# EAGLE schematic KMO_IO_MV2_3 (EAGLE 9.4.0)

## Sheet 1 of 2
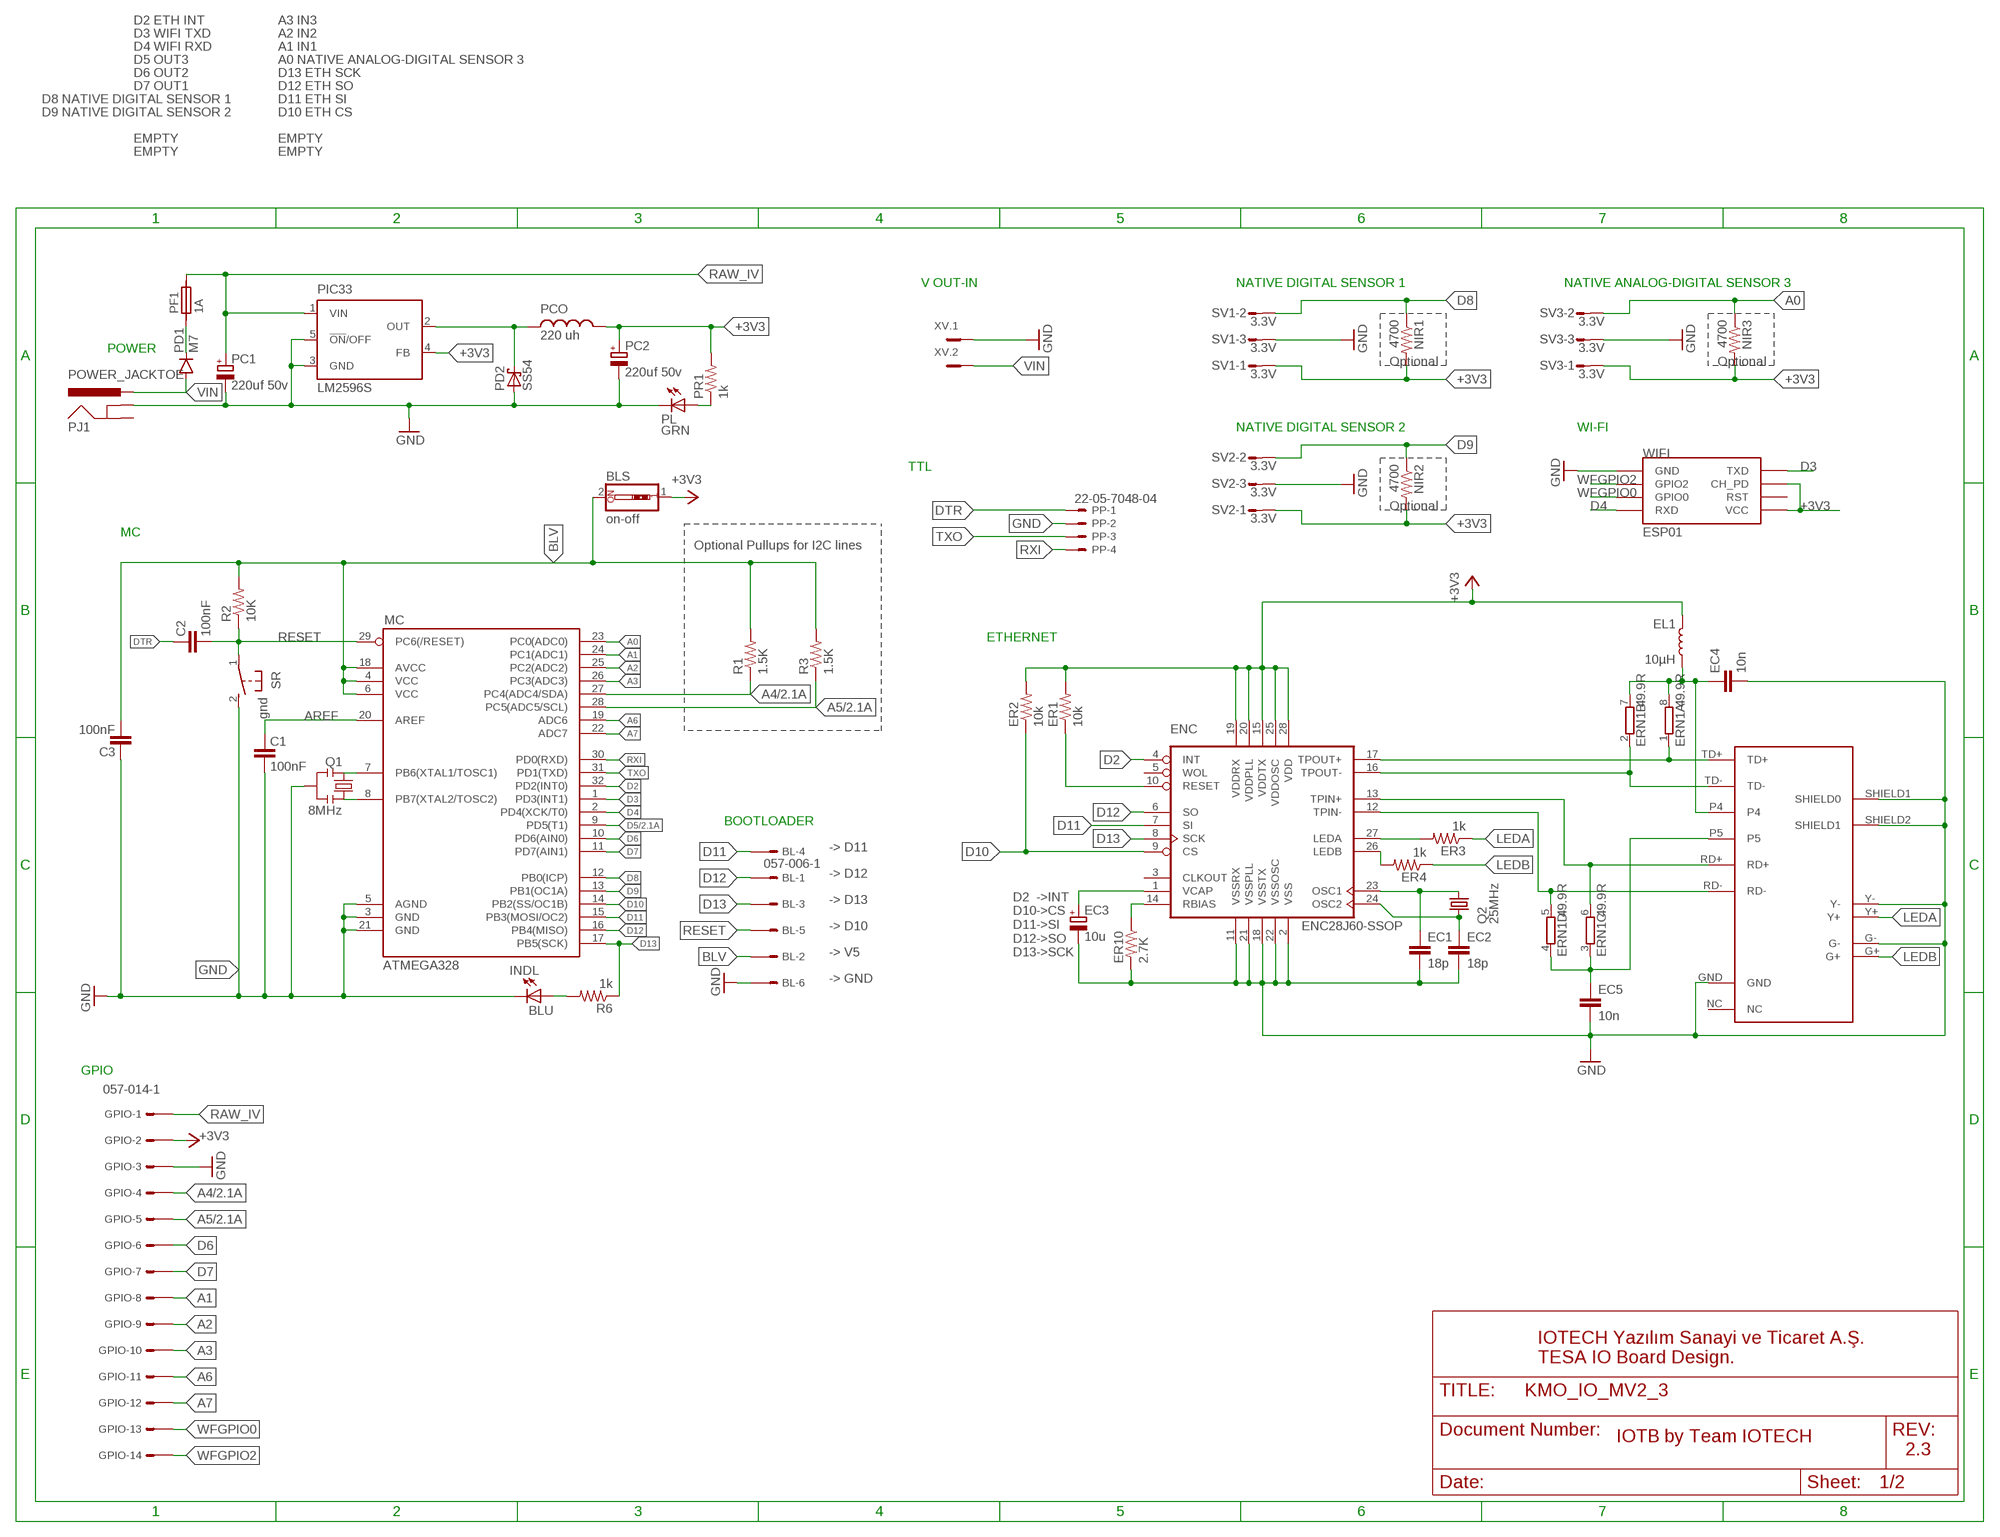
[diagram p0: schematic, sheet 1]

### Parts
BL  057-006-1  [057-006-1]
BLS  on-off  SW_DIP-1  [EDG-01]
C1  100nF  CAP0805  [0805]
C2  100nF  CAP0805  [0805]
C3  100nF  CAP0805  [0805]
EC1  18p  CAP0805  [0805]
EC2  18p  CAP0805  [0805]
EC3  10u  CPOL-EUCT3216  [CT3216]
EC4  10n  CAP0805  [0805]
EC5  10n  CAP0805  [0805]
EL1  10µH  INDUCTOR-0805-3.3UH  [0805]
ENC  ENC28J60-SSOP  [SSOP28]
ER1  10k  RESISTOR0805-RES  [0805]
ER2  10k  RESISTOR0805-RES  [0805]
ER3  1k  RESISTOR0805-RES  [0805]
ER4  1k  RESISTOR0805-RES  [0805]
ER10  2.7K  RESISTOR0805-RES  [0805]
ERN1  49.9R  4R-N0603-ARV  [0603-ARV]
GPIO  057-014-1  [057-014-1]
INDL  BLU  LEDCHIP-LED0805  [CHIP-LED0805]
MC  ATMEGA328  ATMEGA168  [TQFP32-08]
NIR1  4700  RESISTOR0805-RES  [0805]
NIR2  4700  RESISTOR0805-RES  [0805]
NIR3  4700  RESISTOR0805-RES  [0805]
PC1  220uf 50v  CPOL-EU140CLH-1010  [140CLH-1010]
PC2  220uf 50v  CPOL-EU140CLH-1010  [140CLH-1010]
PCO  220 uh  MSS1260  [MSS1260]
PD1  M7  DIODESMA  [SMA-DIODE]
PD2  SS54  SCHOTTKY-DIODESMD  [SMB]
PF1  1A  SIBA194600  [1820]
PIC33  LM2596S  [TO263-5]
PJ1  POWER_JACKTOE  [POWER_JACK_SMD_OVERPASTE_TOE]
PL  GRN  LEDCHIP-LED0805  [CHIP-LED0805]
PP  22-05-7048-04  [7395-04]
PR1  1k  RESISTOR0805-RES  [0805]
Q1  8MHz  RESONATOR1:1  [RESONATOR-SMD-1:1]
Q2  25MHz  KX-9B  [5.0X3.2_2]
R1  1.5K  RESISTOR0805-RES  [0805]
R2  10K  RESISTOR0805-RES  [0805]
R3  1.5K  RESISTOR0805-RES  [0805]
R6  1k  RESISTOR0805-RES  [0805]
SR  gnd  31-XX  [B3F-31XX]
SV1  3.3V  S03P  [S03P]
SV2  3.3V  S03P  [S03P]
SV3  3.3V  S03P  [S03P]
U$2  HR911105A  [RJ45]
WIFI  ESP01  [ESP01]
XV  MC2  [MC2]

### Nets
+3V3 [3.3 power line]: BLS.1 EL1.1 ENC.15(VDDTX) ENC.19(VDDRX) ENC.20(VDDPLL) ENC.25(VDDOSC) ENC.28(VDD) ER1.2 ER2.2 GPIO.2 NIR1.2 NIR2.2 NIR3.2 PC2.+ PCO.P$1 PIC33.4(FB) PR1.2 SV1.1 SV2.1 SV3.1 WIFI.CH_PD WIFI.VCC ; also sheet 2
A0: MC.23(PC0(ADC0)) NIR3.1 SV3.2
A1: GPIO.8 MC.24(PC1(ADC1))
A2: GPIO.9 MC.25(PC2(ADC2))
A3: GPIO.10 MC.26(PC3(ADC3))
A4: GPIO.4 MC.27(PC4(ADC4/SDA)) R1.1 ; also sheet 2
A5: GPIO.5 MC.28(PC5(ADC5/SCL)) R3.1 ; also sheet 2
A6: GPIO.11 MC.19(ADC6)
A7: GPIO.12 MC.22(ADC7)
AREF: C1.2 MC.20(AREF)
BLV: BL.2 BLS.2 C3.1 MC.4(VCC) MC.6(VCC) MC.18(AVCC) R1.2 R2.2 R3.2
D2: ENC.4(INT) MC.32(PD2(INT0))
D3: MC.1(PD3(INT1)) WIFI.TX(TXD)
D4: MC.2(PD4(XCK/T0)) WIFI.RX(RXD)
D5: MC.9(PD5(T1)) ; also sheet 2
D6: GPIO.6 MC.10(PD6(AIN0))
D7: GPIO.7 MC.11(PD7(AIN1))
D8: MC.12(PB0(ICP)) NIR1.1 SV1.2
D9: MC.13(PB1(OC1A)) NIR2.1 SV2.2
D10: ENC.9(CS) ER2.1 MC.14(PB2(SS/OC1B))
D11: BL.4 ENC.7(SI) MC.15(PB3(MOSI/OC2))
D12: BL.1 ENC.6(SO) MC.16(PB4(MISO))
D13: BL.3 ENC.8(SCK) MC.17(PB5(SCK)) R6.1
DTR: C2.2 PP.1
EP4: EC4.1 EL1.2 ERN1.7 ERN1.8 U$2.P4
EP5: EC5.1 ERN1.3 ERN1.4 U$2.P5
GND [3.3 power line]: BL.6 C1.1 C3.2 EC1.2 EC2.2 EC3.- EC4.2 EC5.2 ENC.2(VSS) ENC.11(VSSRX) ENC.18(VSSTX) ENC.21(VSSPLL) ENC.22(VSSOSC) ER10.2 GPIO.3 INDL.C MC.3(GND) MC.5(AGND) MC.21(GND) PC1.- PC2.- PD2.A PIC33.3(GND) PIC33.5(!ON!/OFF) PJ1.GND(GNDBREAK) PL.C PP.2 Q1.2 SR.2(S) SV1.3 SV2.3 SV3.3 U$2.G- U$2.GND U$2.SHIELD1(SHIELD0) U$2.SHIELD2(SHIELD1) U$2.Y- WIFI.GND XV.1 ; also sheet 2
LEDA: ER3.1 U$2.Y+
LEDB: ER4.1 U$2.G+
N$2: PD1.C PF1.1
N$5: INDL.A R6.2
N$9: ENC.27(LEDA) ER3.2
N$10: MC.8(PB7(XTAL2/TOSC2)) Q1.3
N$11: PL.A PR1.1
N$13: EC3.+ ENC.1(VCAP)
N$14: ENC.26(LEDB) ER4.2
N$15: MC.7(PB6(XTAL1/TOSC1)) Q1.1
N$16: PCO.P$2 PD2.C PIC33.2(OUT)
N$17: ENC.10(RESET) ER1.1
N$19: ENC.14(RBIAS) ER10.1
N$22: EC2.1 ENC.24(OSC2) Q2.1
N$24: EC1.1 ENC.23(OSC1) Q2.2
RAW_IV [vcc]: GPIO.1 PC1.+ PF1.2 PIC33.1(VIN)
RD+: ENC.13(TPIN+) ERN1.6 U$2.RD+
RD-: ENC.12(TPIN-) ERN1.5 U$2.RD-
RESET: BL.5 C2.1 MC.29(PC6(/RESET)) R2.1 SR.1(P)
RXI: MC.30(PD0(RXD)) PP.4
TD+: ENC.17(TPOUT+) ERN1.1 U$2.TD+
TD-: ENC.16(TPOUT-) ERN1.2 U$2.TD-
TXO: MC.31(PD1(TXD)) PP.3
VIN: PD1.A PJ1.VIN0(PWR) XV.2
WFGPIO0: GPIO.13 WIFI.GPIO0
WFGPIO2: GPIO.14 WIFI.GPIO2
Unconnected: ENC.3(CLKOUT) ENC.5(WOL) PJ1.P$4(GND) U$2.NC WIFI.RST

### Notes on the sheet
- D2 ETH INT | A3 IN3
- D3 WIFI TXD | A2 IN2
- D4 WIFI RXD | A1 IN1
- D5 OUT3 | A0 NATIVE ANALOG-DIGITAL SENSOR 3
- D6 OUT2 | D13 ETH SCK
- D7 OUT1 | D12 ETH SO
- D8 NATIVE DIGITAL SENSOR 1 | D11 ETH SI
- D9 NATIVE DIGITAL SENSOR 2 | D10 ETH CS
- EMPTY | EMPTY
- EMPTY | EMPTY
- V OUT-IN | NATIVE DIGITAL SENSOR 1 | NATIVE ANALOG-DIGITAL SENSOR 3
- POWER
- Optional | Optional
- NATIVE DIGITAL SENSOR 2 | WI-FI
- TTL
- Optional
- MC
- Optional Pullups for I2C lines
- ETHERNET
- BOOTLOADER
- -> D11
- -> D12
- -> D13
- -> D10
- -> V5
- D2  ->INT
  D10->CS
  D11->SI
  D12->SO
  D13->SCK
- -> GND
- GPIO
- IOTECH Yazılım Sanayi ve Ticaret A.Ş.
  TESA IO Board Design.
- IOTB by Team IOTECH
- 2.3

## Sheet 2 of 2
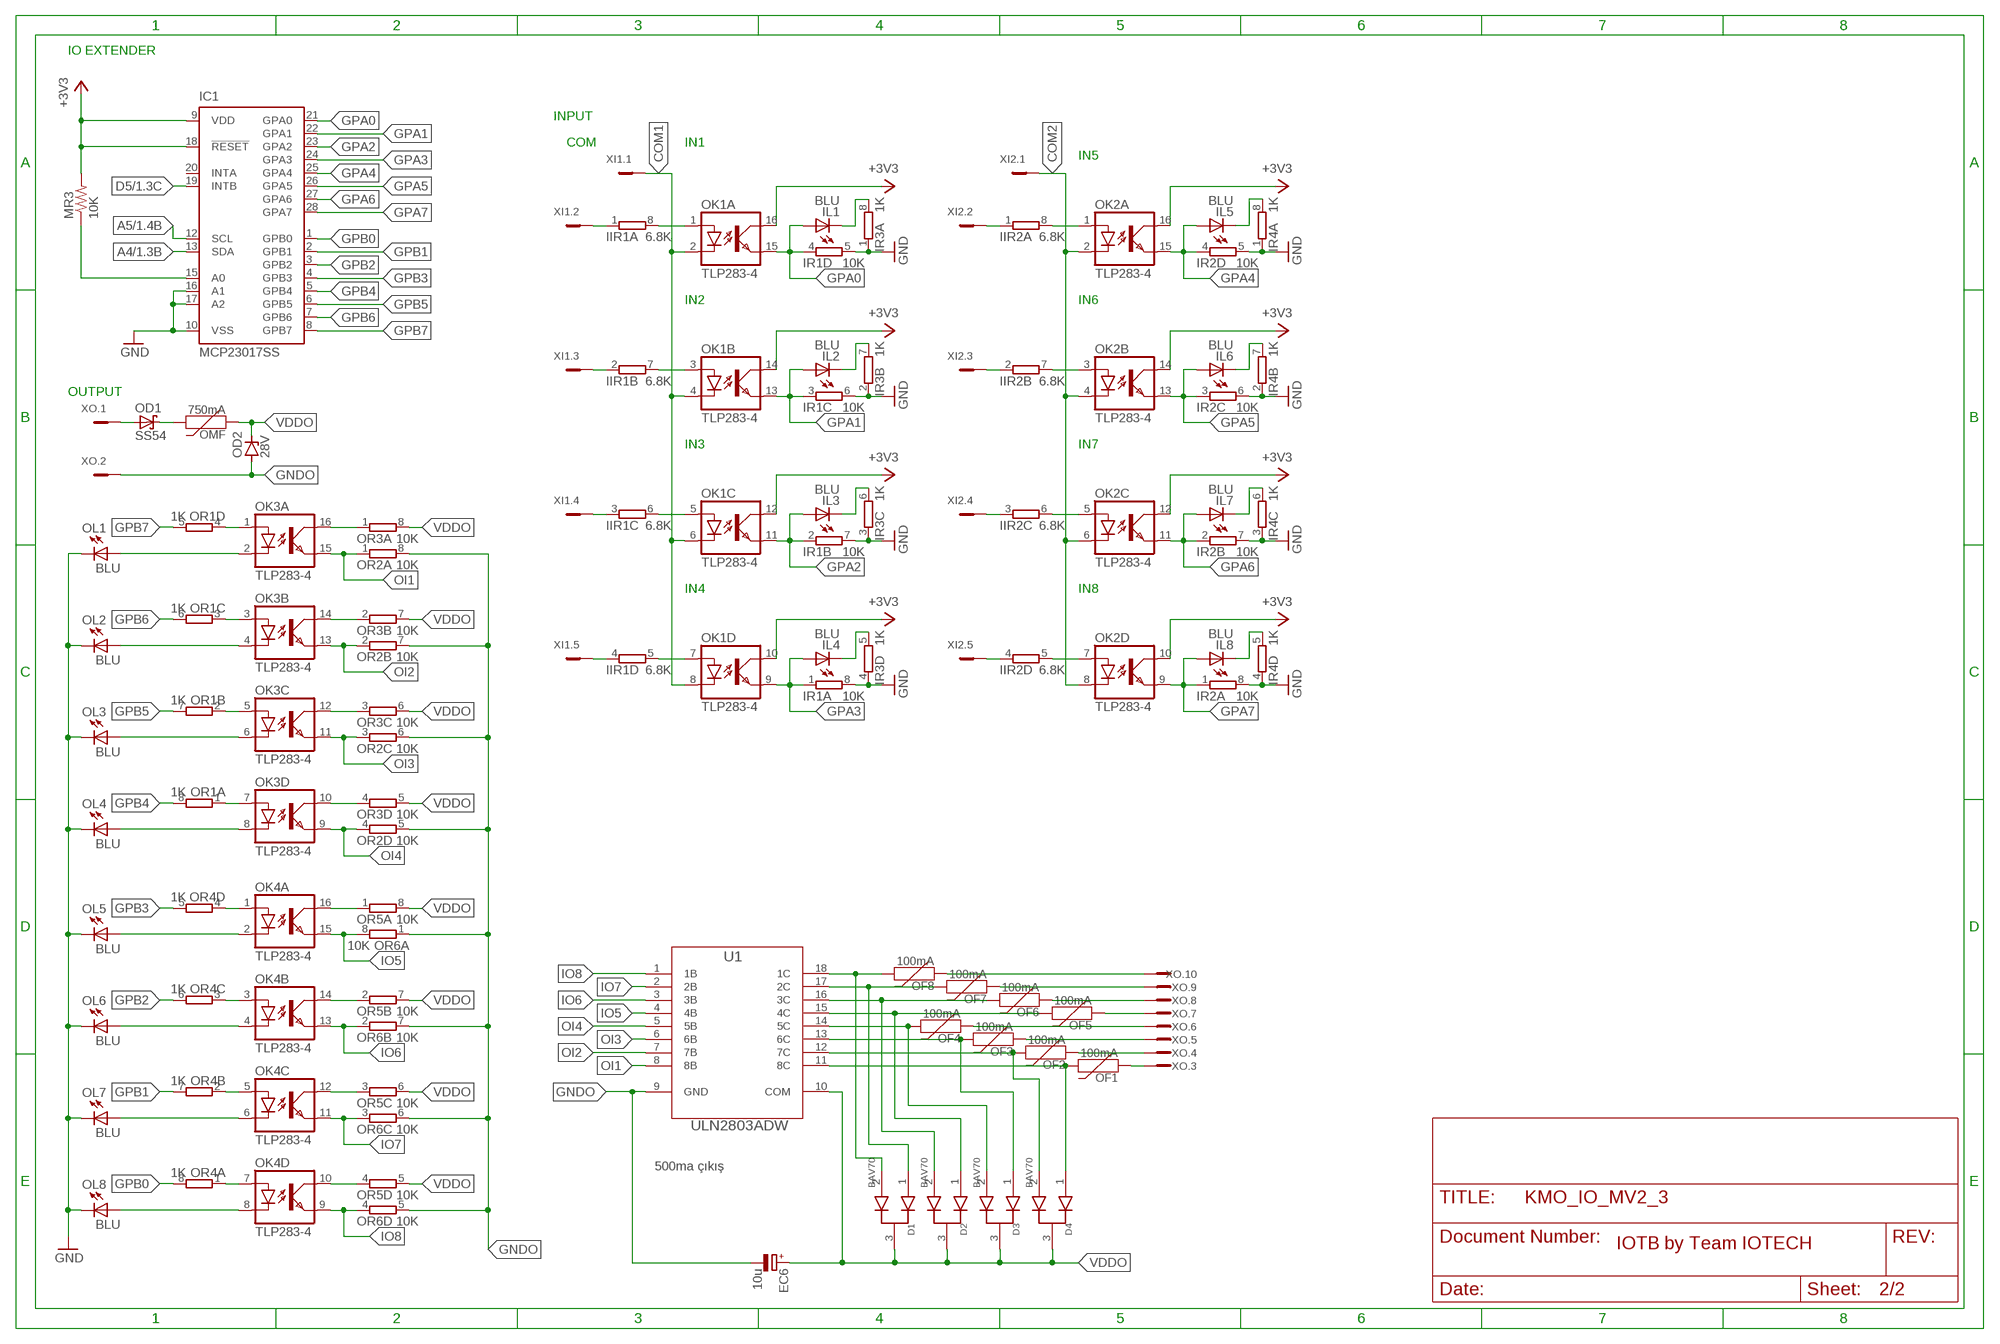
[diagram p1: schematic, sheet 2]

### Parts
D1  BAV70  [SOT-23-3]
D2  BAV70  [SOT-23-3]
D3  BAV70  [SOT-23-3]
D4  BAV70  [SOT-23-3]
EC6  10u  CPOL-EUCT3216  [CT3216]
IC1  MCP23017SS  [SSOP28]
IIR1  6.8K  4R-N0603-ARV  [0603-ARV]
IIR2  6.8K  4R-N0603-ARV  [0603-ARV]
IL1  BLU  LEDCHIP-LED0805  [CHIP-LED0805]
IL2  BLU  LEDCHIP-LED0805  [CHIP-LED0805]
IL3  BLU  LEDCHIP-LED0805  [CHIP-LED0805]
IL4  BLU  LEDCHIP-LED0805  [CHIP-LED0805]
IL5  BLU  LEDCHIP-LED0805  [CHIP-LED0805]
IL6  BLU  LEDCHIP-LED0805  [CHIP-LED0805]
IL7  BLU  LEDCHIP-LED0805  [CHIP-LED0805]
IL8  BLU  LEDCHIP-LED0805  [CHIP-LED0805]
IR1  10K  4R-N0603-ARV  [0603-ARV]
IR2  10K  4R-N0603-ARV  [0603-ARV]
IR3  1K  4R-N0603-ARV  [0603-ARV]
IR4  1K  4R-N0603-ARV  [0603-ARV]
MR3  10K  RESISTOR0805-RES  [0805]
OD1  SS54  SCHOTTKY-DIODESMD  [SMB]
OD2  28V  ZENER-DIODESMB  [SMB]
OF1  100mA  PPTC_0.75A  [1206]
OF2  100mA  PPTC_0.75A  [1206]
OF3  100mA  PPTC_0.75A  [1206]
OF4  100mA  PPTC_0.75A  [1206]
OF5  100mA  PPTC_0.75A  [1206]
OF6  100mA  PPTC_0.75A  [1206]
OF7  100mA  PPTC_0.75A  [1206]
OF8  100mA  PPTC_0.75A  [1206]
OK1  TLP283-4  [MINI-FLAT-16]
OK2  TLP283-4  [MINI-FLAT-16]
OK3  TLP283-4  [MINI-FLAT-16]
OK4  TLP283-4  [MINI-FLAT-16]
OL1  BLU  LEDCHIP-LED0805  [CHIP-LED0805]
OL2  BLU  LEDCHIP-LED0805  [CHIP-LED0805]
OL3  BLU  LEDCHIP-LED0805  [CHIP-LED0805]
OL4  BLU  LEDCHIP-LED0805  [CHIP-LED0805]
OL5  BLU  LEDCHIP-LED0805  [CHIP-LED0805]
OL6  BLU  LEDCHIP-LED0805  [CHIP-LED0805]
OL7  BLU  LEDCHIP-LED0805  [CHIP-LED0805]
OL8  BLU  LEDCHIP-LED0805  [CHIP-LED0805]
OMF  750mA  PPTC_0.75A  [1206]
OR1  1K  4R-N0603-ARV  [0603-ARV]
OR2  10K  4R-N0603-ARV  [0603-ARV]
OR3  10K  4R-N0603-ARV  [0603-ARV]
OR4  1K  4R-N0603-ARV  [0603-ARV]
OR5  10K  4R-N0603-ARV  [0603-ARV]
OR6  10K  4R-N0603-ARV  [0603-ARV]
U1  ULN2803ADW  [SOIC127P1030X265-18N]
XI1  MC5  [MC5]
XI2  MC5  [MC5]
XO  MC10  [MC10]

### Nets
+3V3 [3.3 power line]: IC1.9(VDD) IC1.18(!RESET) MR3.2 OK1.10(D:COL) OK1.12(C:COL) OK1.14(B:COL) OK1.16(A:COL) OK2.10(D:COL) OK2.12(C:COL) OK2.14(B:COL) OK2.16(A:COL) ; also sheet 1
A4: IC1.13(SDA) ; also sheet 1
A5: IC1.12(SCL) ; also sheet 1
COM1: OK1.2(A:C) OK1.4(B:C) OK1.6(C:C) OK1.8(D:C) XI1.1
COM2: OK2.2(A:C) OK2.4(B:C) OK2.6(C:C) OK2.8(D:C) XI2.1
D5: IC1.19(INTB) ; also sheet 1
GND [3.3 power line]: IC1.10(VSS) IC1.16(A1) IC1.17(A2) IR1.5 IR1.6 IR1.7 IR1.8 IR2.5 IR2.6 IR2.7 IR2.8 IR3.1 IR3.2 IR3.3 IR3.4 IR4.1 IR4.2 IR4.3 IR4.4 OL1.C OL2.C OL3.C OL4.C OL5.C OL6.C OL7.C OL8.C ; also sheet 1
GNDO [outsise power line]: EC6.- OD2.A OR2.5 OR2.6 OR2.7 OR2.8 OR6.1 OR6.5 OR6.6 OR6.7 U1.9(GND) XO.2
GPA0: IC1.21(GPA0) IL1.A IR1.4 OK1.15(A:EMIT)
GPA1: IC1.22(GPA1) IL2.A IR1.3 OK1.13(B:EMIT)
GPA2: IC1.23(GPA2) IL3.A IR1.2 OK1.11(C:EMIT)
GPA3: IC1.24(GPA3) IL4.A IR1.1 OK1.9(D:EMIT)
GPA4: IC1.25(GPA4) IL5.A IR2.4 OK2.15(A:EMIT)
GPA5: IC1.26(GPA5) IL6.A IR2.3 OK2.13(B:EMIT)
GPA6: IC1.27(GPA6) IL7.A IR2.2 OK2.11(C:EMIT)
GPA7: IC1.28(GPA7) IL8.A IR2.1 OK2.9(D:EMIT)
GPB0: IC1.1(GPB0) OR4.8
GPB1: IC1.2(GPB1) OR4.7
GPB2: IC1.3(GPB2) OR4.6
GPB3: IC1.4(GPB3) OR4.5
GPB4: IC1.5(GPB4) OR1.8
GPB5: IC1.6(GPB5) OR1.7
GPB6: IC1.7(GPB6) OR1.6
GPB7: IC1.8(GPB7) OR1.5
IO5: OK4.15(A:EMIT) OR6.8 U1.4(4B)
IO6: OK4.13(B:EMIT) OR6.2 U1.3(3B)
IO7: OK4.11(C:EMIT) OR6.3 U1.2(2B)
IO8: OK4.9(D:EMIT) OR6.4 U1.1(1B)
N$1: OD1.A XO.1
N$3: IC1.15(A0) MR3.1
N$4: OD1.C OMF.2
N$6: OF8.1 XO.10
N$7: D1.1 OF7.2 U1.17(2C)
N$8: OK3.1(A:A) OR1.4
N$12: IL1.C IR3.8
N$18: IIR1.1 XI1.2
N$20: IL2.C IR3.7
N$21: IL3.C IR3.6
N$23: IL4.C IR3.5
N$25: IL5.C IR4.8
N$26: IL6.C IR4.7
N$27: IL7.C IR4.6
N$28: IIR1.2 XI1.3
N$29: IIR1.8 OK1.1(A:A)
N$30: IIR1.7 OK1.3(B:A)
N$31: IIR1.6 OK1.5(C:A)
N$32: IIR1.5 OK1.7(D:A)
N$33: IIR1.3 XI1.4
N$34: IIR1.4 XI1.5
N$35: OK3.3(B:A) OR1.3
N$36: IIR2.1 XI2.2
N$37: IIR2.8 OK2.1(A:A)
N$38: IIR2.2 XI2.3
N$39: IIR2.7 OK2.3(B:A)
N$40: IIR2.3 XI2.4
N$41: IIR2.6 OK2.5(C:A)
N$42: IIR2.4 XI2.5
N$43: IIR2.5 OK2.7(D:A)
N$44: IL8.C IR4.5
N$45: OK3.5(C:A) OR1.2
N$46: OK3.7(D:A) OR1.1
N$47: D1.2 OF8.2 U1.18(1C)
N$48: OK3.16(A:COL) OR3.1
N$49: D2.2 OF6.2 U1.16(3C)
N$50: D2.1 OF5.2 U1.15(4C)
N$51: OF7.1 XO.9
N$52: OF6.1 XO.8
N$53: OK3.14(B:COL) OR3.2
N$54: OF5.1 XO.7
N$55: OF4.1 XO.6
N$56: OK3.12(C:COL) OR3.3
N$57: D3.1 OF3.2 U1.13(6C)
N$58: OK3.10(D:COL) OR3.4
N$59: D4.2 OF2.2 U1.12(7C)
N$60: OK3.2(A:C) OL1.A
N$61: OK3.4(B:C) OL2.A
N$62: OK3.6(C:C) OL3.A
N$63: OK3.8(D:C) OL4.A
N$64: D4.1 OF1.2 U1.11(8C)
N$65: D3.2 OF4.2 U1.14(5C)
N$66: OF3.1 XO.5
N$67: OF2.1 XO.4
N$68: OF1.1 XO.3
N$69: OK4.1(A:A) OR4.4
N$70: OK4.3(B:A) OR4.3
N$71: OK4.5(C:A) OR4.2
N$72: OK4.7(D:A) OR4.1
N$73: OK4.16(A:COL) OR5.1
N$74: OK4.14(B:COL) OR5.2
N$75: OK4.12(C:COL) OR5.3
N$76: OK4.10(D:COL) OR5.4
N$77: OK4.2(A:C) OL5.A
N$78: OK4.4(B:C) OL6.A
N$79: OK4.6(C:C) OL7.A
N$80: OK4.8(D:C) OL8.A
OI1: OK3.15(A:EMIT) OR2.1 U1.8(8B)
OI2: OK3.13(B:EMIT) OR2.2 U1.7(7B)
OI3: OK3.11(C:EMIT) OR2.3 U1.6(6B)
OI4: OK3.9(D:EMIT) OR2.4 U1.5(5B)
VDDO [outsise power line]: D1.3 D2.3 D3.3 D4.3 EC6.+ OD2.C OMF.1 OR3.5 OR3.6 OR3.7 OR3.8 OR5.5 OR5.6 OR5.7 OR5.8 U1.10(COM)
Unconnected: IC1.20(INTA)

### Notes on the sheet
- IO EXTENDER
- INPUT
- COM | IN1
- IN5
- IN2 | IN6
- OUTPUT
- IN3 | IN7
- IN4 | IN8
- 500ma çıkış
- IOTB by Team IOTECH

## Library data of the parts
BL = con-panduit:057-006-: CONNECTOR 6-pin series 057 contact pc board low profile headers; OC_FARNELL: unknown; OC_NEWARK: unknown
BLS = special:SW_DIP-1: DIP SWITCH
C1-C3 EC1 EC2 EC4 EC5 = SparkFun-Passives:CAP: Capacitor Standard 0603 ceramic capacitor, and 0.1" leaded capacitor.
D1-D4 = BAV70:BAV70; AVAILABILITY: Unavailable; DESCRIPTION: Diode, Dual Switching, Sot-23; MF: Multicomp; MP: BAV70+; PACKAGE: SOT-23 Multicomp; PRICE: None
EC3 EC6 PC1 PC2 = rcl:CPOL-EU: POLARIZED CAPACITOR, European symbol; SPICEPREFIX: C
EL1 = SparkFun-Coils:INDUCTOR: Inductors Resist changes in electrical current. Basically a coil of wire. SparkFun Products: SparkFun Load Cell Amplifier - HX711 <https://www.sparkfun.com/products/13879> IOIO-OTG - V2.2 <https://www.sparkfun.com/products/13613>; PROD_ID: NDUC-13076; VALUE: 3.3µH/±20%/450mA
ENC = microchip-enc28j60:ENC28J60-*: Microchip 10Mbit Eth. contoller with SPI interface
ER1-ER4 ER10 MR3 NIR1-NIR3 PR1 R1-R3 R6 = SparkFun-Passives:RESISTOR: Resistor Basic schematic elements and footprints for 0603, 1206, and PTH resistors.
ERN1 IIR1 IIR2 IR1-IR4 OR1-OR6 = resistor-dil:4R-N: Array Chip Resistor Source: RS Component / Phycomp; OC_FARNELL: unknown; OC_NEWARK: unknown
GPIO = con-panduit:057-014-: CONNECTOR 10-pin series 057 contact pc board low profile headers; OC_FARNELL: unknown; OC_NEWARK: unknown
IC1 = microchip:MCP23017: http://ww1.microchip.com/downloads/en/DeviceDoc/21952a.pdf Source: http://ww1.microchip.com/downloads/en/DeviceDoc/21952a.pdf; MF: MICROCHIP; MPN: MCP23017-E/SS; OC_FARNELL: 1467674; OC_NEWARK: 31K2960
IL1-IL8 INDL OL1-OL8 PL = led:LED: LED OSRAM: - CHIPLED LG R971, LG N971, LY N971, LG Q971, LY Q971, LO R971, LY R971 LH N974, LH R974 LS Q976, LO Q976, LY Q976 LO Q996 - Hyper CHIPLED LW Q18S LB Q993, LB Q99A, LB R99A - SideLED LS A670, LO A670, LY A670, LG A670, LP A670 LB A673, LV A673, LT A673, LW A673 LH A674 LY A675 LS A676, LA A676, LO A676, LY A676, LW A676 LS A679, LY A679, LG A679 - Hyper Micro SIDELED® LS Y876, LA Y876, LO Y876, LY Y876 LT Y87S - SmartLED LW L88C, LW L88S LB L89C, LB L89S, LG L890 LS L89K, LO L89K, LY L89K LS L896, LA L896, LO L896, LY L896 - TOPLED LS T670, LO T670, LY T670, LG T670, LP T670 LSG T670, LSP T670, LSY T670, LOP T670, LYG T670 LG T671, LOG T671, LSG T671 LB T673, LV T673, LT T673, LW T673 LH T674 LS T676, LA T676, LO T676, LY T676, LB T676, LH T676, LSB T676, LW T676 LB T67C, LV T67C, LT T67C, LS T67K, LO T67K, LY T67K, LW E67C LS E67B, LA E67B, LO E67B, LY E67B, LB E67C, LV E67C, LT E67C LW T67C LS T679, LY T679, LG T679 LS T770, LO T770, LY T770, LG T770, LP T770 LB T773, LV T773, LT T773, LW T773 LH T774 LS E675, LA E675, LY E675, LS T675 LS T776, LA T776, LO T776, LY T776, LB T776 LHGB T686 LT T68C, LB T68C - Hyper Mini TOPLED® LB M676 - Mini TOPLED Santana® LG M470 LS M47K, LO M47K, LY M47K Source: http://www.osram.convergy.de LUXEON: - LUMILED® LXK2-PW12-R00, LXK2-PW12-S00, LXK2-PW14-U00, LXK2-PW14-V00 LXK2-PM12-R00, LXK2-PM12-S00, LXK2-PM14-U00 LXK2-PE12-Q00, LXK2-PE12-R00, LXK2-PE12-S00, LXK2-PE14-T00, LXK2-PE14-U00 LXK2-PB12-K00, LXK2-PB12-L00, LXK2-PB12-M00, LXK2-PB14-N00, LXK2-PB14-P00, LXK2-PB14-Q00 LXK2-PR12-L00, LXK2-PR12-M00, LXK2-PR14-Q00, LXK2-PR14-R00 LXK2-PD12-Q00, LXK2-PD12-R00, LXK2-PD12-S00 LXK2-PH12-R00, LXK2-PH12-S00 LXK2-PL12-P00, LXK2-PL12-Q00, LXK2-PL12-R00 Source: www.luxeon.com KINGBRIGHT: KA-3528ASYC Source: www.kingbright.com
MC = SparkFun:ATMEGA168
OD1 PD2 = diode:SCHOTTKY-DIODE: Schottky Diode
OD2 = diode:ZENER-DIODE: Z-Diode
OF1-OF8 OMF = SparkFun-Fuses:PPTC: Resettable Fuse PPTC Resettable Fuse. Really a sort of resistor with a polymeric positive temperature coefficient whose resistance increases dramatically with an increase in temperature. When heated by the power passing through the resistance rises causing the current to be limited, protecting the circuit. This is achieved by the transition of the polymer from a crystalline to an amorphous state where the conductive carbon separates breaking the conductive pathways found in the cool crystalline structure. When a PPTC cools back down it resumes conducting letting the circuit turn back on. SparkFun Products: SparkFun RedBoard - Programmed with Arduino <https://www.sparkfun.com/products/12757> Pro Micro - 5V/16MHz <https://www.sparkfun.com/products/12640> Arduino Pro 328 - 5V/16MHz <https://www.sparkfun.com/products/10915> MP3 Trigger <https://www.sparkfun.com/products/13720>; PROD_ID: RES-11150; VALUE: 6V/0.75A
OK1 OK2 = optocoupler:TLP283-4: TOSHIBA PHOTOCOUPLER GaAs IRED & PHOTO-TRANSISTOR Source: http://www.semicon.toshiba.co.jp/td/en/Opto/Photocoupler/en_20050928_TLP283_datasheet.pdf; OC_FARNELL: unknown; OC_NEWARK: unknown; SPICEPREFIX: O
OK3 OK4 = optocoupler:TLP283-4: TOSHIBA PHOTOCOUPLER GaAs IRED & PHOTO-TRANSISTOR Source: http://www.semicon.toshiba.co.jp/td/en/Opto/Photocoupler/en_20050928_TLP283_datasheet.pdf; OC_FARNELL: unknown; OC_NEWARK: unknown
PCO = inductor-coilcraft:MSS1260: SMT Power Inductor
PD1 = SparkFun-DiscreteSemi:DIODE: Diode These are standard reverse protection diodes and small signal diodes. SMA package can handle up to about 1A. SOD-323 can handle about 200mA. What the SOD-323 package when ordering, there are some mfgs out there that are 5-pin packages.
PF1 = _hhn_PtcFuses_Siba_r500_Ozan:SIBA194600*: SIBA PTC-Fuses, Series 194600, 1812 (4.5 3.2)mm Source: www.siba.de/ Package: SMD 1812 (4.5 x 3.2)mm Technologies: SIBA194600Axxx xxx: Trip-Current * 10 mA Author: Dipl.-Ing. FH Rainer Bayer
PIC33 = national-semiconductor:LM2596: SIMPLE SWITCHER® Power Converter 150 kHz 3A Step-Down Voltage Regulator Source: http://www.national.com/ds/LM/LM2596.pdf; MF: NATIONAL SEMICONDUCTOR; MPN: LM2596S-ADJ/NOPB; OC_FARNELL: 9494367; OC_NEWARK: 41K3842
PJ1 = SparkFun-Connectors:POWER_JACK: Power Jack Connector This is the standard 5.5mm barrel jack for power. The PTH is the most common, proven, reliable, footprint. The Slot footprint only works if the mill layer is transmitted to the PCB fab house so be warned. Here are the connectors we sell at SparkFun: DC Barrel Power Jack/Connector <https://www.sparkfun.com/products/119> (PRT-00119) DC Barrel Power Jack/Connector (SMD) <https://www.sparkfun.com/products/12748> (PRT-12748) DC Barrel Jack Adapter - Breadboard Compatible <https://www.sparkfun.com/products/10811> (PRT-10811) It is used on this SparkFun product (and many, many others): SparkFun RedBoard - Programmed with Arduino <https://www.sparkfun.com/products/12757> (DEV-12757) Also, if you need a mating power supply or connector, please check these out: Wall Adapter Power Supply - 9VDC 650mA <https://www.sparkfun.com/products/298> (TOL-00298) DC Barrel Jack Adapter - Male <https://www.sparkfun.com/products/10287> (PRT-10287); PROD_ID: CONN-08106; SF_ID: PRT-12748
PP = con-molex:22-?-04: CONNECTOR wire to board 2.54 mm (.1 inch) pitch header; MF: MOLEX; OC_FARNELL: unknown; OC_NEWARK: unknown
Q1 = Testing:RESONATOR: Resonator Small SMD resonator. This is the itty bitty 10/20MHz resonators with built in caps. CSTCE10M0G55 and CSTCE20M0V53. Footprint for SMD has been used in SFE production for years, and does work okay. 1:1 is an attempt to get larger fillets on the sides so it will be easier to inspect these solders in our AOI machine. The pads have been minimized to match the actual metal under the resonator. To see this relation, it includes an image import of the bottom side of the component. Imported to scale on layer 200.
Q2 = crystal-geyer_V1_0:KX: Quartz Crystals (MHz) SMD: KX - Serie Model Size l/w/h [mm] Frequency Range Frequency Stability Temp. Range [°C] Load Capacitance AECQ 200 availabel Datasheet KX-4 KX-5 KX-6 KX-7 KX-9A KX-9B KX-12A KX-12B KX-13 KX-20 KX-K KX-KS 1.6/1.2/0.3 2.0/1.6/0.45 2.5/2.0/0.55 3.2/2.5/0.8 5.0/3.2/1.0 5.0/3.2/1.1 6.0/3.5/1.1 6.0/3.5/1.0 7.0/5.0 /1.3 11.6/5.5/1.6 12.3/4.5/4.2 12.3/4.5/3.2 24.0 ~ 80.0 MHz 16.0 ~ 80.0 MHz 12.0 ~ 80.0 MHz 8.0 ~ 60.0 MHz 7,68 ~ 300,0 MHz 8,0 ~ 50,0 MHz 8,0 ~ 150,0 MHz 8,0 ~ 50,0 MHz 6,0 ~ 160,0 MHz 3,579 ~ 25,0 MHz 3,579 ~ 70,0 MHz 3,579 ~ 70,0 MHz ±10 … ±50ppm ±10 … ±50ppm ±10 … ±50ppm ±10 … ±50ppm ±10 … ±50ppm ±10 … ±50ppm ±10 … ±50ppm ±10 … ±50ppm ±10 … ±50ppm ±50ppm ±10 … ±50ppm ±10 … ±50ppm (*) -40°C …+85°C (*) -40°C …+125°C (*) -40°C …+125°C (*) -40°C …+125°C (*) -40°C …+105°C (*) -40°C …+105°C (*) -40°C …+125°C (*) -40°C …+105°C (*) -40°C …+105°C (*) -40°C …+105°C (*) -40°C …+85°C (*) -40°C …+85°C 8, 8…16 8, 8…16 10, 8…16 12, 7…20 16, 10…20 16, 10…20 16, 10…20 16, 12…20 16, 12…20 16, 12…20 16, 12…30 16, 12…30 - yes yes yes - - - - - - - - KX-4.pdf <http://www.geyer-electronic.de/uploads/tx_userartikelfrequenz/GEYER-KX-4.pdf> KX-5.pdf <http://www.geyer-electronic.de/uploads/tx_userartikelfrequenz/GEYER-KX-5.pdf> KX-6.pdf <http://www.geyer-electronic.de/uploads/tx_userartikelfrequenz/GEYER-KX-6.pdf> KX-7.pdf <http://www.geyer-electronic.de/uploads/tx_userartikelfrequenz/GEYER-KX-7.pdf> KX-9A.pdf <http://www.geyer-electronic.de/uploads/tx_userartikelfrequenz/GEYER-KX-9A.pdf> KX-9B.pdf <http://www.geyer-electronic.de/uploads/tx_userartikelfrequenz/GEYER-KX-9B.pdf> KX-12A.pdf <http://www.geyer-electronic.de/uploads/tx_userartikelfrequenz/GEYER-KX-12A.pdf> KX-12B.pdf <http://www.geyer-electronic.de/uploads/tx_userartikelfrequenz/GEYER-KX-12B.pdf> KX-13.pdf <http://www.geyer-electronic.de/uploads/tx_userartikelfrequenz/GEYER-KX-13.pdf> KX-20.pdf <http://www.geyer-electronic.de/uploads/tx_userartikelfrequenz/GEYER-KX-20.pdf> KX-K.pdf <http://www.geyer-electronic.de/uploads/tx_userartikelfrequenz/GEYER-KX-K.pdf> KX-KS.pdf <http://www.geyer-electronic.de/uploads/tx_userartikelfrequenz/GEYER-KX-KS.pdf> <http://www.geyer-electronic.de/fileadmin/template/img/logo-geyer-electronic.png> Details see: http://www.geyer-electronic.de/Frequenz-Produkte.9.0.html Created 2016-06-07, Hans Locher 2016 (C) Geyer Quartz Technology KX4,KX5,KX6,KX7,KX9A,KX9B,KX12A,KX12B,KX13,KX20,KXK,KXKS;1612;2016;2520;3225;5032;6035;7050;11655;12345;1,6x1,2;2,0x1,6;2,5x2,0;3,2x2,5;5,0x3,2;6,0x3,5;7,0x5,0;11,6x5,5;12,3x4,5;12,3x4,5;1.6x1.2;2.0x1.6;2.5x2.0;3.2x2.5;5.0x3.2;6.0x3.5;7.0x5.0;11.6x5.5;12.3x4.5;12.3x4.5;
SR = switch-omron:31-XX: OMRON SWITCH; MPN: B3F-3100; OC_FARNELL: 959704; OC_NEWARK: 36M3582
SV1-SV3 = con_io_sxp:S03P: AMP MT CONNECTOR
U1 = ULN2803ADW:ULN2803ADW: Darlington transistor array; MPN: ULN2803ADW; OC_FARNELL: 1652419; OC_NEWARK: 69K0711; PACKAGE: SOIC-18; SUPPLIER: TEXAS INSTRUMENTS
U$2 = HR911105A:HR911105A
WIFI = esp8266modules:ESP01: ESP8266 Wifi module 01
XI1 XI2 = con-phoenix-381_l:MC5: Mini-Combicon 3.81mm horizontal 5-polig (ohne Gegenstecker)
XO = con-phoenix-381_l:MC10: Mini-Combicon 3.81mm horizontal 10-polig (ohne Gegenstecker)
XV = con-phoenix-381_l:MC2: Mini-Combicon 3.81mm horizontal 2-polig (ohne Gegenstecker)

## Net classes
0 default: width 0.203 mm, drill 0.3 mm, clearance 0.16 mm
1 vcc: width 0.254 mm, drill 0.3 mm, clearance 0.16 mm
2 3.3 power line: width 0.254 mm, drill 0.3 mm, clearance 0.16 mm
3 outsise power line: width 0.254 mm, drill 0.3 mm, clearance 0.16 mm